# EasyEDA Pro project ProProject_运放实验_2024-09-24.epro, board PCB_all
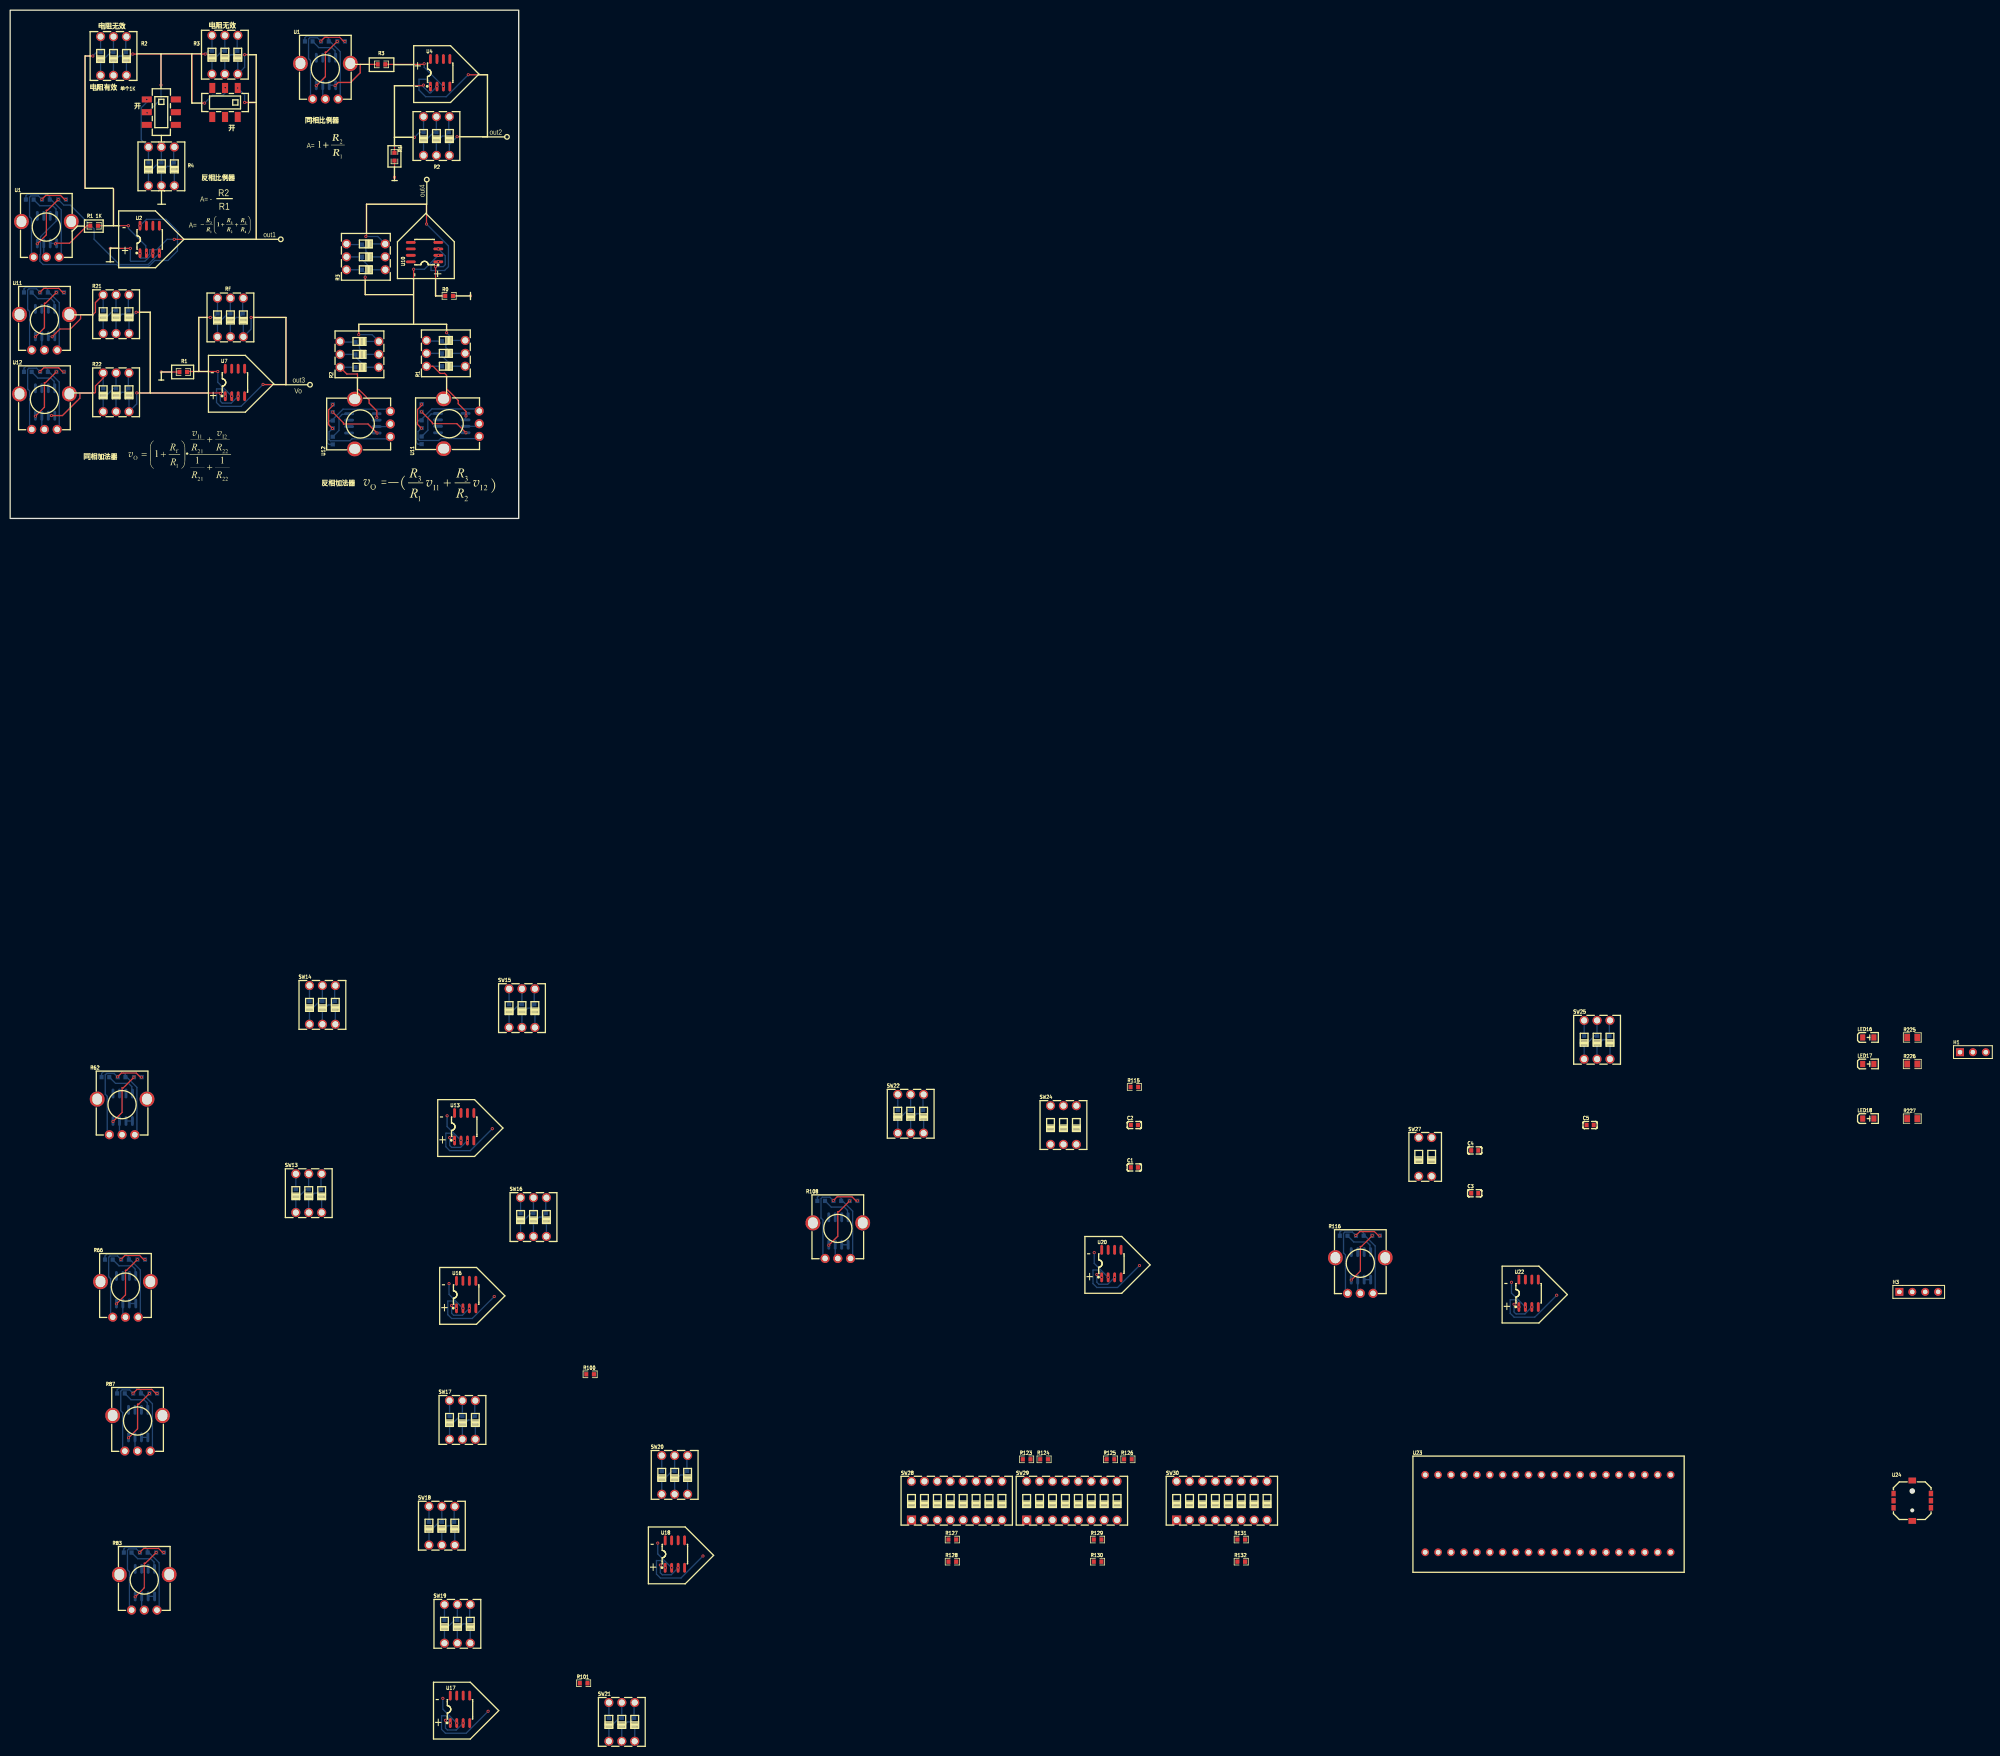
[diagram p9: board, top side]
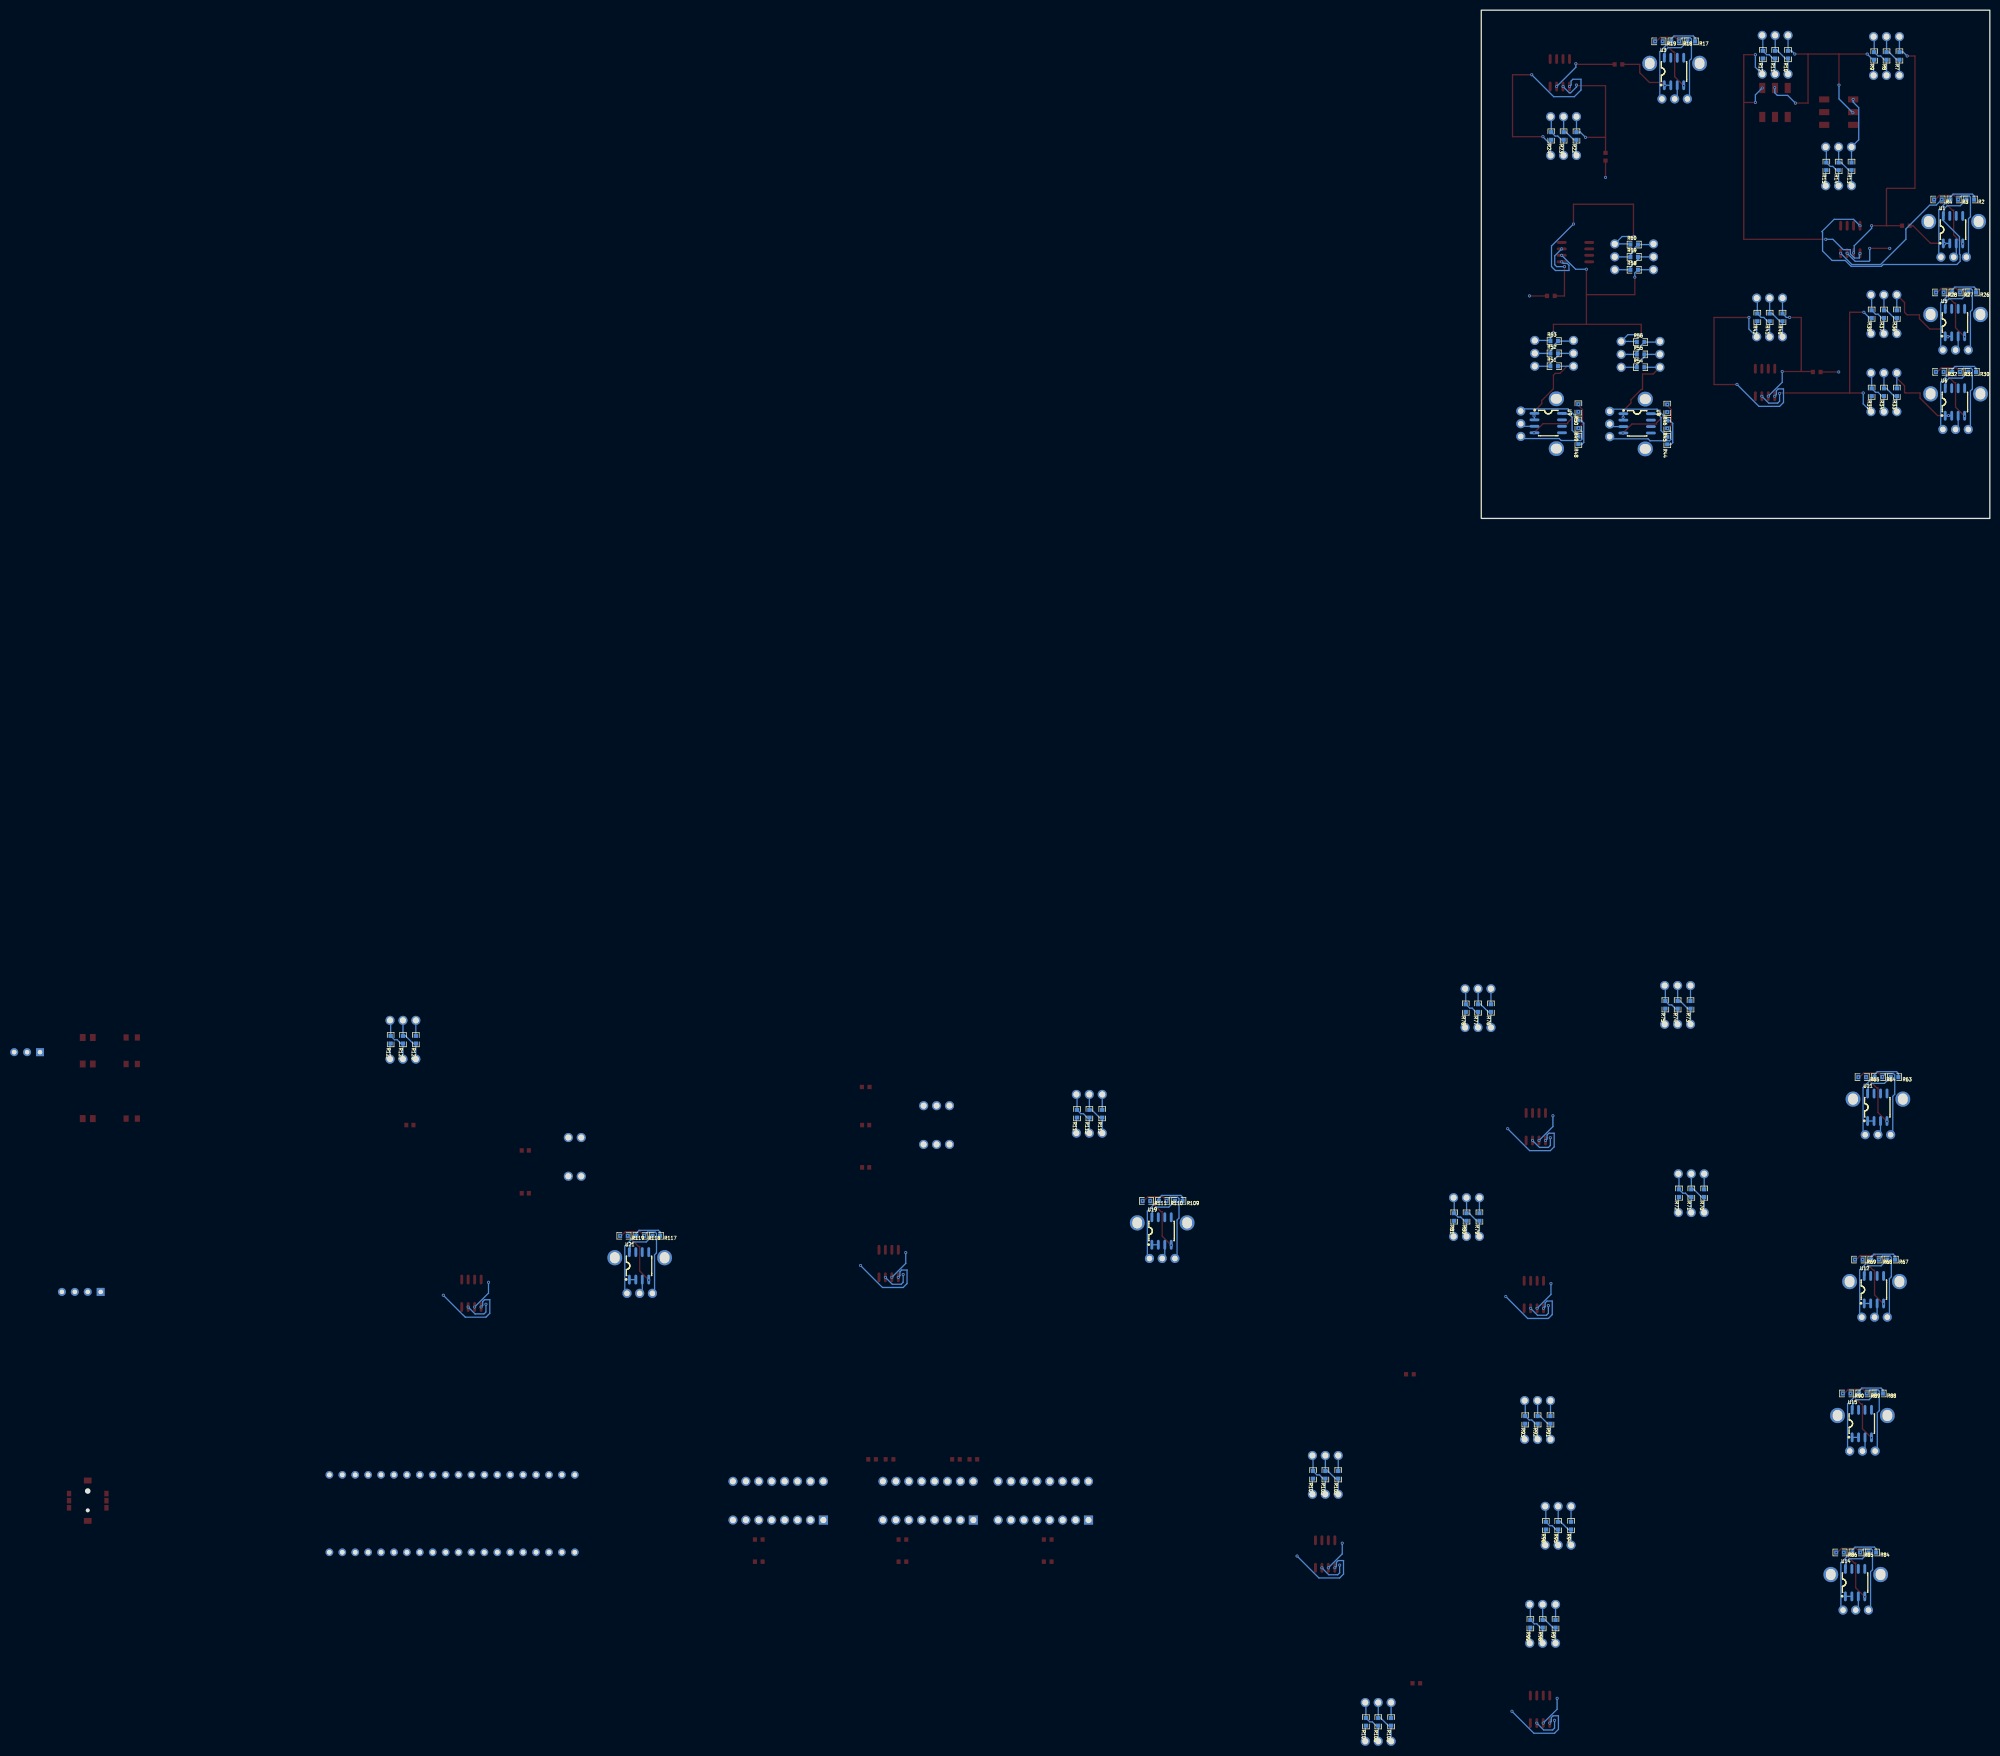
[diagram p10: board, bottom side, seen from below]

Outline 374.56 x 295.55 mm; copper layers: Top Layer, Bottom Layer. Coordinates in mm from the lower left corner of the outline.
Outline path: rectangle 0,295.55 100,195.55
Stack: Top Layer 0.035mm - / Dielectric1 1.51mm FR4 er 4.5 / Bottom Layer 0.035mm -

## Design rules (mm)
template: JLCPCB Capability(Two Layers Board)
spacing copperThickness1oz (default): track to track 0.102, other pairs 0.152 to 0.3
spacing copperThickness2oz: track to track 0.203, other pairs 0.152 to 0.3
track width copperThickness1oz (default): min 0.127, default 0.254, max 2.54
track width copperThickness2oz: min 0.203, default 0.254, max 2.54
differential pair differentialPair (default): width min 0.127, default 0.254, max 2.54; gap min 0.152, default 0.152
via viaSize (default): diameter min 0.5, default 0.61, max 10; hole min 0.3, default 0.305, max 6.3

## Placement (name value [footprint] x y rotation side)
C1  100uF  [C0603]  221.06 67.86 0 top
C2  1uF  [C0603]  221.06 76.2 0 top
C3  100uF  [C0603]  287.98 62.78 0 top
C4  1uF  [C0603]  287.98 71.21 0 top
C5  1uF  [C0603]  310.67 76.2 0 top
H1  HDR-F-2.54_1x3  [HDR-F-2.54_1X3]  385.94 90.54 0 top
H3  HDR-F-2.54_1x4  [HDR-F-2.54_1X4]  375.29 43.38 0 top
LED16  -  [LED_0805]  365.42 93.43 0 top
LED17  -  [LED_0805]  365.42 88.21 0 top
LED18  -  [LED_0805]  365.42 77.47 0 top
R0  1kΩ  [R0603]  86.32 239.34 0 top
R1  1kΩ  [SW-TH_DSWB03LHGET]  85.67 228.03 90 top
R1 1K  1kΩ  [R0603]  16.51 253.14 180 top
R1#2  -  [R0603]  75.56 266.72 270 top
R1#3  -  [R0603]  34.04 224.36 180 top
R2  4kΩ  [SW-TH_DSWB03LHGET]  20.32 286.53 0 top
R2#2  -  [SW-TH_DSWB03LHGET]  83.82 270.78 0 top
R2#3  -  [SW-TH_DSWB03LHGET]  68.68 227.83 90 top
R2#4  -  [R0603]  3.84 258.29 0 bottom
R3  2kΩ  [SW-TH_DSWB03LHGET]  42.22 286.78 0 top
R3#2  -  [SW-TH_DSWB03LHGET]  69.94 247.02 90 top
R3#3  -  [R0603]  73.03 284.88 180 top
R3#4  -  [R0603]  7.02 258.29 0 bottom
R4  4kΩ  [SW-TH_DSWB03LHGET]  29.74 264.82 0 top
R4#2  -  [R0603]  10.21 258.29 0 bottom
R7  1kΩ  [R0603]  17.78 286.54 90 bottom
R8  1kΩ  [R0603]  20.31 286.54 90 bottom
R9  1kΩ  [R0603]  22.73 286.54 90 bottom
R10  1kΩ  [R0603]  39.68 286.8 90 bottom
R11  1kΩ  [R0603]  42.21 286.8 90 bottom
R12  1kΩ  [R0603]  44.63 286.8 90 bottom
R13  1kΩ  [R0603]  27.2 264.83 90 bottom
R14  1kΩ  [R0603]  29.73 264.83 90 bottom
R15  1kΩ  [R0603]  32.15 264.83 90 bottom
R17  4kΩ  [R0603]  58.71 289.41 0 bottom
R18  2kΩ  [R0603]  61.89 289.41 0 bottom
R19  4kΩ  [R0603]  65.07 289.41 0 bottom
R21  1kΩ  [SW-TH_DSWB03LHGET]  20.83 235.73 0 top
R22  1kΩ  [SW-TH_DSWB03LHGET]  20.83 220.37 0 top
R22#2  -  [R0603]  81.28 270.8 90 bottom
R23  1kΩ  [R0603]  83.81 270.8 90 bottom
R24  1kΩ  [R0603]  86.23 270.8 90 bottom
R26  4kΩ  [R0603]  3.47 240.01 0 bottom
R27  2kΩ  [R0603]  6.65 240.01 0 bottom
R28  4kΩ  [R0603]  9.83 240.01 0 bottom
R30  4kΩ  [R0603]  3.47 224.39 0 bottom
R31  2kΩ  [R0603]  6.65 224.39 0 bottom
R32  4kΩ  [R0603]  9.83 224.39 0 bottom
R33  1kΩ  [R0603]  18.29 220.38 90 bottom
R34  1kΩ  [R0603]  20.82 220.38 90 bottom
R35  1kΩ  [R0603]  23.24 220.38 90 bottom
R36  1kΩ  [R0603]  18.29 235.74 90 bottom
R37  1kΩ  [R0603]  20.82 235.74 90 bottom
R38  1kΩ  [R0603]  23.24 235.74 90 bottom
R40  1kΩ  [R0603]  40.77 235.11 90 bottom
R41  1kΩ  [R0603]  43.3 235.11 90 bottom
R42  1kΩ  [R0603]  45.72 235.11 90 bottom
R44  4kΩ  [R0603]  63.42 210.86 90 bottom
R45  2kΩ  [R0603]  63.42 214.04 90 bottom
R46  4kΩ  [R0603]  63.42 217.23 90 bottom
R48  4kΩ  [R0603]  80.9 210.92 90 bottom
R49  2kΩ  [R0603]  80.9 214.1 90 bottom
R50  4kΩ  [R0603]  80.9 217.28 90 bottom
R51  1kΩ  [R0603]  85.66 225.49 180 bottom
R52  1kΩ  [R0603]  85.66 228.02 180 bottom
R53  1kΩ  [R0603]  85.66 230.45 180 bottom
R54  1kΩ  [R0603]  68.67 225.29 180 bottom
R55  1kΩ  [R0603]  68.67 227.82 180 bottom
R56  1kΩ  [R0603]  68.67 230.25 180 bottom
R58  1kΩ  [R0603]  69.93 244.48 180 bottom
R59  1kΩ  [R0603]  69.93 247.01 180 bottom
R60  1kΩ  [R0603]  69.93 249.43 180 bottom
R62  1kΩ  [RES-ADJ-TH_RK09K1130AJ3]  22 77.8 0 top
R63  4kΩ  [R0603]  18.74 85.63 0 bottom
R64  2kΩ  [R0603]  21.91 85.63 0 bottom
R65  4kΩ  [R0603]  25.1 85.63 0 bottom
R66  1kΩ  [RES-ADJ-TH_RK09K1130AJ3]  22.67 41.9 0 top
R67  4kΩ  [R0603]  19.4 49.73 0 bottom
R68  2kΩ  [R0603]  22.58 49.73 0 bottom
R69  4kΩ  [R0603]  25.77 49.73 0 bottom
R70  1kΩ  [R0603]  56.17 62.81 90 bottom
R71  1kΩ  [R0603]  58.7 62.81 90 bottom
R72  1kΩ  [R0603]  61.12 62.81 90 bottom
R73  1kΩ  [R0603]  58.86 99.85 90 bottom
R74  1kΩ  [R0603]  61.38 99.85 90 bottom
R75  1kΩ  [R0603]  63.81 99.85 90 bottom
R76  1kΩ  [R0603]  98.1 99.22 90 bottom
R77  1kΩ  [R0603]  100.63 99.22 90 bottom
R78  1kΩ  [R0603]  103.05 99.22 90 bottom
R79  1kΩ  [R0603]  100.37 58.11 90 bottom
R80  1kΩ  [R0603]  102.89 58.11 90 bottom
R81  1kΩ  [R0603]  105.32 58.11 90 bottom
R83  1kΩ  [RES-ADJ-TH_RK09K1130AJ3]  26.37 -15.73 0 top
R84  4kΩ  [R0603]  23.1 -7.9 0 bottom
R85  2kΩ  [R0603]  26.28 -7.9 0 bottom
R86  4kΩ  [R0603]  29.46 -7.9 0 bottom
R87  1kΩ  [RES-ADJ-TH_RK09K1130AJ3]  25.05 15.56 0 top
R88  4kΩ  [R0603]  21.78 23.39 0 bottom
R89  2kΩ  [R0603]  24.96 23.39 0 bottom
R90  4kΩ  [R0603]  28.14 23.39 0 bottom
R91  1kΩ  [R0603]  86.39 18.19 90 bottom
R92  1kΩ  [R0603]  88.92 18.19 90 bottom
R93  1kΩ  [R0603]  91.35 18.19 90 bottom
R94  1kΩ  [R0603]  82.35 -2.61 90 bottom
R95  1kΩ  [R0603]  84.88 -2.61 90 bottom
R96  1kΩ  [R0603]  87.3 -2.61 90 bottom
R97  1kΩ  [R0603]  85.4 -21.92 90 bottom
R98  1kΩ  [R0603]  87.92 -21.92 90 bottom
R99  1kΩ  [R0603]  90.35 -21.92 90 bottom
R100  1kΩ  [R0603]  114.04 27.16 0 top
R101  1kΩ  [R0603]  112.77 -33.62 0 top
R102  1kΩ  [R0603]  128.12 7.38 90 bottom
R103  1kΩ  [R0603]  130.65 7.38 90 bottom
R104  1kΩ  [R0603]  133.08 7.38 90 bottom
R105  1kΩ  [R0603]  117.73 -41.21 90 bottom
R106  1kΩ  [R0603]  120.26 -41.21 90 bottom
R107  1kΩ  [R0603]  122.68 -41.21 90 bottom
R108  1kΩ  [RES-ADJ-TH_RK09K1130AJ3]  162.74 53.45 0 top
R109  4kΩ  [R0603]  159.48 61.28 0 bottom
R110  2kΩ  [R0603]  162.65 61.28 0 bottom
R111  4kΩ  [R0603]  165.84 61.28 0 bottom
R112  1kΩ  [R0603]  174.53 78.43 90 bottom
R113  1kΩ  [R0603]  177.06 78.43 90 bottom
R114  1kΩ  [R0603]  179.49 78.43 90 bottom
R115  1MΩ  [R0603]  221.06 83.7 0 top
R116  1kΩ  [RES-ADJ-TH_RK09K1130AJ3]  265.49 46.6 0 top
R117  4kΩ  [R0603]  262.22 54.43 0 bottom
R118  2kΩ  [R0603]  265.4 54.43 0 bottom
R119  4kΩ  [R0603]  268.58 54.43 0 bottom
R120  1kΩ  [R0603]  309.5 93 90 bottom
R121  1kΩ  [R0603]  312.03 93 90 bottom
R122  1kΩ  [R0603]  314.45 93 90 bottom
R123  1kΩ  [R0603]  199.88 10.43 0 top
R124  1kΩ  [R0603]  203.3 10.43 0 top
R125  1kΩ  [R0603]  216.36 10.43 0 top
R126  1kΩ  [R0603]  219.79 10.43 0 top
R127  7kΩ  [R0603]  185.25 -5.35 0 top
R128  3kΩ  [R0603]  185.25 -9.7 0 top
R129  7kΩ  [R0603]  213.82 -5.35 0 top
R130  3kΩ  [R0603]  213.82 -9.7 0 top
R131  7kΩ  [R0603]  242.07 -5.35 0 top
R132  3kΩ  [R0603]  242.07 -9.7 0 top
R225  1k  [R0805]  374.02 93.43 0 top
R226  1k  [R0805]  374.02 88.21 0 top
R227  1k  [R0805]  374.02 77.47 0 top
RF  DSWB03LHGET  [SW-TH_DSWB03LHGET]  43.31 235.1 0 top
SW13  DSWB03LHGET  [SW-TH_DSWB03LHGET]  58.71 62.8 0 top
SW14  DSWB03LHGET  [SW-TH_DSWB03LHGET]  61.4 99.84 0 top
SW15  DSWB03LHGET  [SW-TH_DSWB03LHGET]  100.64 99.21 0 top
SW16  DSWB03LHGET  [SW-TH_DSWB03LHGET]  102.91 58.1 0 top
SW17  DSWB03LHGET  [SW-TH_DSWB03LHGET]  88.93 18.18 0 top
SW18  DSWB03LHGET  [SW-TH_DSWB03LHGET]  84.89 -2.62 0 top
SW19  DSWB03LHGET  [SW-TH_DSWB03LHGET]  87.94 -21.93 0 top
SW20  DSWB03LHGET  [SW-TH_DSWB03LHGET]  130.66 7.37 0 top
SW21  DSWB03LHGET  [SW-TH_DSWB03LHGET]  120.27 -41.22 0 top
SW22  DSWB03LHGET  [SW-TH_DSWB03LHGET]  177.07 78.42 0 top
SW24  DSWB03LHGET  [SW-TH_DSWB03LHGET]  207.11 76.2 0 top
SW25  DSWB03LHGET  [SW-TH_DSWB03LHGET]  312.04 92.98 0 top
SW27  DSWB02LHGET  [SW-TH_DSWB02LHGET]  278.24 69.94 0 top
SW28  DSWB08LHGET  [SW-TH_DSWB08LHGET]  186.12 2.3 0 top
SW29  DSWB08LHGET  [SW-TH_DSWB08LHGET]  208.77 2.3 0 top
SW30  DSWB08LHGET  [SW-TH_DSWB08LHGET]  238.26 2.3 0 top
SW31  MST22D18G2  [SW-SMD_MST22D18G2]  29.72 275.48 270 top
SW32  MST22D18G2  [SW-SMD_MST22D18G2]  42.24 277.39 180 top
U1  LM393DR  [RES-ADJ-TH_RK09K1130AJ3]  7.11 250.46 0 top
U1#2  -  [RES-ADJ-TH_RK09K1130AJ3]  61.98 281.58 0 top
U1#3  -  [SOIC-8_L5.0-W4.0-P1.27-LS6.0-BL]  7.24 252.37 180 bottom
U2  LM393DR  [SOIC-8_L5.0-W4.0-P1.27-LS6.0-BL]  27.43 250.44 0 top
U3  LM393DR  [SOIC-8_L5.0-W4.0-P1.27-LS6.0-BL]  62.1 283.48 180 bottom
U4  LM393DR  [SOIC-8_L5.0-W4.0-P1.27-LS6.0-BL]  84.55 283.23 0 top
U5  LM393DR  [SOIC-8_L5.0-W4.0-P1.27-LS6.0-BL]  6.86 234.08 180 bottom
U6  LM393DR  [SOIC-8_L5.0-W4.0-P1.27-LS6.0-BL]  6.86 218.46 180 bottom
U7  LM393DR  [SOIC-8_L5.0-W4.0-P1.27-LS6.0-BL]  44.2 222.3 0 top
U8  LM393DR  [SOIC-8_L5.0-W4.0-P1.27-LS6.0-BL]  69.35 214.26 270 bottom
U9  LM393DR  [SOIC-8_L5.0-W4.0-P1.27-LS6.0-BL]  86.83 214.31 270 bottom
U10  LM393DR  [SOIC-8_L5.0-W4.0-P1.27-LS6.0-BL]  81.48 247.95 90 top
U11  LM393DR  [RES-ADJ-TH_RK09K1130AJ3]  6.74 232.18 0 top
U11#2  -  [RES-ADJ-TH_RK09K1130AJ3]  88.73 214.19 90 top
U11#3  -  [SOIC-8_L5.0-W4.0-P1.27-LS6.0-BL]  22.13 79.7 180 bottom
U12  LM393DR  [RES-ADJ-TH_RK09K1130AJ3]  6.74 216.56 0 top
U12#2  -  [RES-ADJ-TH_RK09K1130AJ3]  71.25 214.13 90 top
U12#3  -  [SOIC-8_L5.0-W4.0-P1.27-LS6.0-BL]  22.8 43.81 180 bottom
U13  LM393DR  [SOIC-8_L5.0-W4.0-P1.27-LS6.0-BL]  89.28 75.87 0 top
U14  LM393DR  [SOIC-8_L5.0-W4.0-P1.27-LS6.0-BL]  26.5 -13.83 180 bottom
U15  LM393DR  [SOIC-8_L5.0-W4.0-P1.27-LS6.0-BL]  25.18 17.46 180 bottom
U16  LM393DR  [SOIC-8_L5.0-W4.0-P1.27-LS6.0-BL]  89.66 42.85 0 top
U17  LM393DR  [SOIC-8_L5.0-W4.0-P1.27-LS6.0-BL]  88.45 -38.75 0 top
U18  LM393DR  [SOIC-8_L5.0-W4.0-P1.27-LS6.0-BL]  130.7 -8.21 0 top
U19  LM393DR  [SOIC-8_L5.0-W4.0-P1.27-LS6.0-BL]  162.87 55.36 180 bottom
U20  LM393DR  [SOIC-8_L5.0-W4.0-P1.27-LS6.0-BL]  216.53 48.95 0 top
U21  LM393DR  [SOIC-8_L5.0-W4.0-P1.27-LS6.0-BL]  265.61 48.5 180 bottom
U22  LM393DR  [SOIC-8_L5.0-W4.0-P1.27-LS6.0-BL]  298.58 43.11 0 top
U23  STM32最小系统-fh  [STM32最小系统板]  302.37 0.27 0 top
U24  GT-TCA06F-H050-L1  [KEY-SMD_GT-TCA06F-H050-L1]  374.02 2.3 0 top

## Footprints (pads in the part's own frame, mm; a bottom-side part is the same pattern mirrored in y, then rotated)
C0603
  rect 0.8x0.9 smd: 1(-0.7,0) 2(0.7,0)
HDR-F-2.54_1X3
  rect 1.575x1.575 hole 0.889: 1(-2.54,0)
  round 1.575 hole 0.889: 2(0,0)
  round 1.575 hole 0.914: 3(2.54,0)
HDR-F-2.54_1X4
  rect 1.575x1.575 hole 0.889: 1(-3.81,0)
  round 1.575 hole 0.889: 2(-1.27,0) 3(1.27,0) 4(3.81,0)
KEY-SMD_GT-TCA06F-H050-L1
  rect 0.85x1.1 smd: 1(-3.675,1.4) 2(-3.675,0) 3(-3.675,-1.4) 4(3.675,1.4) 5(3.675,0) 6(3.675,-1.4)
  rect 1.5x1.15 smd: 7(0,3.975) 8(0,-3.975)
LED_0805
  rect 1x1.25 smd: 1(-1.15,0.005) 2(1.05,0.005)
R0603
  rect 0.806x0.864 smd: 1(-0.753,0) 2(0.753,0)
R0805
  rect 1.133x1.377 smd: 1(-1,0) 2(1,0)
RES-ADJ-TH_RK09K1130AJ3
  round 1.8 hole 1.1: 1(-2.5,-3.5) 2(0,-3.5) 3(2.5,-3.5)
  oval 2.9x3 hole 1.9x2.2: 4(-4.9,3.5) 5(4.9,3.5)
SOIC-8_L5.0-W4.0-P1.27-LS6.0-BL
  oval 0.569x1.95 smd: 1(-1.905,-2.705) 2(-0.635,-2.705) 3(0.635,-2.705) 4(1.905,-2.705) 5(1.905,2.705) 6(0.635,2.705) 7(-0.635,2.705) 8(-1.905,2.705)
STM32最小系统板
  round 1.524 hole 0.919x0.914: 1(-24.13,7.112) 2(-21.59,7.112) 3(-19.05,7.112) 4(-16.51,7.112) 5(-13.97,7.112) 6(-11.43,7.112) 7(-8.89,7.112) 8(-6.35,7.112) 9(-3.81,7.112) 10(-1.27,7.112) 11(1.27,7.112) 12(3.81,7.112) 13(6.35,7.112) 14(8.89,7.112) 15(11.43,7.112) 16(13.97,7.112) 17(16.51,7.112) 18(19.05,7.112) 19(21.59,7.112) 20(24.13,7.112) 21(24.13,-8.128) 22(21.59,-8.128) 23(19.05,-8.128) 24(16.51,-8.128) 25(13.97,-8.128) 26(11.43,-8.128) 27(8.89,-8.128) 28(6.35,-8.128) 29(3.81,-8.128) 30(1.27,-8.128) 31(-1.27,-8.128) 32(-3.81,-8.128) 33(-6.35,-8.128) 34(-8.89,-8.128) 35(-11.43,-8.128) 36(-13.97,-8.128) 37(-16.51,-8.128) 38(-19.05,-8.128) 39(-21.59,-8.128) 40(-24.13,-8.128)
SW-SMD_MST22D18G2
  rect 1.2x2 smd: 1(-2.5,2.85) 2(0,2.85) 3(2.5,2.85) 4(-2.5,-2.85) 5(0,-2.85) 6(2.5,-2.85)
SW-TH_DSWB02LHGET
  round 1.8 hole 1.2: 1(-1.27,3.81) 2(1.27,3.81) 3(-1.27,-3.81) 4(1.27,-3.81)
SW-TH_DSWB03LHGET
  round 1.8 hole 1.2: 1(-2.54,3.81) 2(0,3.81) 3(2.54,3.81) 4(-2.54,-3.81) 5(0,-3.81) 6(2.54,-3.81)
SW-TH_DSWB08LHGET
  rect 1.8x1.8 hole 1.2: 1(-8.89,-3.81)
  round 1.8 hole 1.2: 2(-6.35,-3.81) 3(-3.81,-3.81) 4(-1.27,-3.81) 5(1.27,-3.81) 6(3.81,-3.81) 7(6.35,-3.81) 8(8.89,-3.81) 9(-8.89,3.81) 10(-6.35,3.81) 11(-3.81,3.81) 12(-1.27,3.81) 13(1.27,3.81) 14(3.81,3.81) 15(6.35,3.81) 16(8.89,3.81)

## Nets
+5V: LED17.2 R2#4.2 R17.2 R26.2 R30.2 R44.2 R48.2 R63.2 R67.2 R84.2 R88.2 R109.2 R117.2 U1#3.8 U2.8 U3.8 U4.8 U5.8 U6.8 U7.8 U8.8 U9.8 U10.8 U11#3.8 U12#3.8 U13.8 U14.8 U15.8 U16.8 U17.8 U18.8 U19.8 U20.8 U21.8 U22.8
-5V: H1.2 H3.1 R4#2.1 R19.1 R28.1 R32.1 R46.1 R50.1 R65.1 R69.1 R86.1 R90.1 R111.1 R119.1 R128.1 R130.1 R132.1 R225.1 R227.1 U1#3.4 U2.4 U3.4 U4.4 U5.4 U6.4 U7.4 U8.4 U9.4 U10.4 U11#3.4 U12#3.4 U13.4 U14.4 U15.4 U16.4 U17.4 U18.4 U19.4 U20.4 U21.4 U22.4 U23.1 U23.2 U23.22
GND: H1.3 LED16.2 R0.2 R1#2.2 R1#3.2 R4.6 R15.1 R78.1 R107.1 R123.2 R124.2 R125.2 R126.2 R226.1 SW15.6 SW21.6 U2.3 U20.3 U22.3
1_FAN_XIANG_BI_LI_QI_IN: R1 1K.2 SW28.1 U1#3.1 U1#3.2
1_FAN_XIANG_BI_LI_QI_OUT: R3.6 R12.1 SW30.1 SW32.4 U2.1
2_TONG_XIANG_BI_LI_QI_IN: R3#3.2 SW28.2 U3.1 U3.2
2_TONG_XIANG_BI_LI_QI_OUT: R2#2.6 R24.1 SW30.2 U4.1
3_TONG_XIANG_JIA_FA_QI_IN1: R21.1 R36.2 SW28.3 U5.1 U5.2
3_TONG_XIANG_JIA_FA_QI_IN2: R22.1 R33.2 SW29.3 U6.1 U6.2
3_TONG_XIANG_JIA_FA_QI_OUT: R42.1 RF.6 SW30.3 U7.1
4_FAN_XIANG_JIA_FA_QI_IN1: R2#3.1 R54.2 SW28.4 U8.1 U8.2
4_FAN_XIANG_JIA_FA_QI_IN2: R1.1 R51.2 SW29.4 U9.1 U9.2
4_FAN_XIANG_JIA_FA_QI_OUT: R3#2.6 R60.1 SW30.4 U10.1
5_JIAN_FA_QI_IN1: R73.2 SW14.1 SW28.5 U11#3.1 U11#3.2
5_JIAN_FA_QI_IN2: R70.2 SW13.1 SW29.5 U12#3.1 U12#3.2
5_JIAN_FA_QI_OUT: R81.1 SW16.6 SW30.5 U13.1
6_YI_YONG_FANG_DA_QI_IN1: SW28.6 U15.1 U15.2 U16.3
6_YI_YONG_FANG_DA_QI_IN2: SW29.6 U14.1 U14.2 U17.3
6_YI_YONG_FANG_DA_QI_OUT: R104.1 SW20.6 SW30.6 U18.1
7_JI_FEN_IN: R112.2 SW22.1 SW28.7 U19.1 U19.2
7_JI_FEN_OUT: C1.2 C2.2 R115.1 SW30.7 U20.1
8_WEI_FEN_IN: SW27.1 SW27.2 SW28.8 U21.1 U21.2
8_WEI_FEN_OUT: C5.2 R122.1 SW25.6 SW30.8 U22.1
-5+3.3V: H1.1 H3.2 LED18.2 U23.3 U23.21 U24.2
A0: R127.1 R128.2 U23.16
A1: R129.1 R130.2 U23.15
A2: R131.1 R132.2 U23.14
A3: U23.13
A4: U23.12
A5: U23.11
A6: U23.10
A7: U23.9
A8: U23.36 U24.1
A9: U23.35 U24.3
A10: U23.34 U24.6
A11: U23.33 U24.5
A12: U23.32 U24.4
A15: U23.31
B0: U23.8
B1: U23.7
B3: U23.30
B4: U23.29
B5: U23.28
B6: U23.27
B7: U23.26
B8: H3.3 U23.25
B9: H3.4 U23.24
B10: U23.6
B11: U23.5
B12: U23.40
B13: U23.39
B14: U23.38
B15: U23.37
C13: U23.19
C14: U23.18
C15: U23.17
RST: U23.4
VBT: U23.20
$1N396: R2#4.1 R3#4.2 U1.3
$1N406: R3#4.1 R4#2.2 U1.1
$1N426: U1.2 U1#3.3
$1N864: R2.2 R2.4 R7.1 R8.2
$1N884: R2.3 R2.5 R8.1 R9.2
$1N1057: R3.2 R3.4 R10.1 R11.2
$1N1065: R3.3 R3.5 R11.1 R12.2
$1N1238: R4.2 R4.4 R13.1 R14.2
$1N1246: R4.3 R4.5 R14.1 R15.2
$1N1500: R1 1K.1 R2.1 R7.2 U2.2
$1N1717: R4.1 R13.2 SW31.4
$1N1726: R2.6 R3.1 R9.1 R10.2 SW31.5 SW32.5
$1N1964: R17.1 R18.2 U1#2.3
$1N1967: R18.1 R19.2 U1#2.1
$1N1978: U1#2.2 U3.3
$1N2081: R3#3.1 U4.3
$1N2301: R2#2.2 R2#2.4 R22#2.1 R23.2
$1N2309: R2#2.3 R2#2.5 R23.1 R24.2
$1N2335: R1#2.1 R2#2.1 R22#2.2 U4.2
$1N2569: R26.1 R27.2 U11.3
$1N2572: R27.1 R28.2 U11.1
$1N2583: U5.3 U11.2
$1N2820: R30.1 R31.2 U12.3
$1N2823: R31.1 R32.2 U12.1
$1N2834: U6.3 U12.2
$1N3003: R22.2 R22.4 R33.1 R34.2
$1N3011: R22.3 R22.5 R34.1 R35.2
$1N3184: R21.2 R21.4 R36.1 R37.2
$1N3192: R21.3 R21.5 R37.1 R38.2
$1N3292: R21.6 R22.6 R35.1 R38.1 U7.3
$1N3532: R40.1 R41.2 RF.2 RF.4
$1N3540: R41.1 R42.2 RF.3 RF.5
$1N3559: R1#3.1 R40.2 RF.1 U7.2
$1N4590: R44.1 R45.2 U12#2.3
$1N4593: R45.1 R46.2 U12#2.1
$1N4604: U8.3 U12#2.2
$1N4614: R48.1 R49.2 U11#2.3
$1N4617: R49.1 R50.2 U11#2.1
$1N4628: U9.3 U11#2.2
$1N4635: R1.2 R1.4 R51.1 R52.2
$1N4643: R1.3 R1.5 R52.1 R53.2
$1N4651: R2#3.2 R2#3.4 R54.1 R55.2
$1N4659: R2#3.3 R2#3.5 R55.1 R56.2
$1N4698: R3#2.2 R3#2.4 R58.1 R59.2
$1N4706: R3#2.3 R3#2.5 R59.1 R60.2
$1N4742: R1.6 R2#3.6 R3#2.1 R53.1 R56.1 R58.2 U10.2
$1N4816: R0.1 U10.3
$1N5564: R62.3 R63.1 R64.2
$1N5567: R62.1 R64.1 R65.2
$1N5578: R62.2 U11#3.3
$1N5588: R66.3 R67.1 R68.2
$1N5591: R66.1 R68.1 R69.2
$1N5602: R66.2 U12#3.3
$1N5609: R70.1 R71.2 SW13.2 SW13.4
$1N5617: R71.1 R72.2 SW13.3 SW13.5
$1N5625: R73.1 R74.2 SW14.2 SW14.4
$1N5633: R74.1 R75.2 SW14.3 SW14.5
$1N5932: R76.1 R77.2 SW15.2 SW15.4
$1N5940: R77.1 R78.2 SW15.3 SW15.5
$1N5959: R75.1 R76.2 SW14.6 SW15.1 U13.3
$1N6163: R79.1 R80.2 SW16.2 SW16.4
$1N6171: R80.1 R81.2 SW16.3 SW16.5
$1N6191: R72.1 R79.2 SW13.6 SW16.1 U13.2
$1N6501: R83.3 R84.1 R85.2
$1N6504: R83.1 R85.1 R86.2
$1N6515: R83.2 U14.3
$1N6753: R87.3 R88.1 R89.2
$1N6756: R87.1 R89.1 R90.2
$1N6767: R87.2 U15.3
$1N7112: R91.1 R92.2 SW17.2 SW17.4
$1N7120: R92.1 R93.2 SW17.3 SW17.5
$1N7297: R94.1 R95.2 SW18.2 SW18.4
$1N7305: R95.1 R96.2 SW18.3 SW18.5
$1N7478: R97.1 R98.2 SW19.2 SW19.4
$1N7486: R98.1 R99.2 SW19.3 SW19.5
$1N7519: R91.2 R94.2 SW17.1 SW18.1 U16.2
$1N7528: R93.1 R100.2 SW17.6 U16.1
$1N7610: R96.1 R99.1 SW18.6 SW19.6 U17.2
$1N7723: R97.2 R101.2 SW19.1 U17.1
$1N7950: R102.1 R103.2 SW20.2 SW20.4
$1N7958: R103.1 R104.2 SW20.3 SW20.5
$1N8133: R105.1 R106.2 SW21.2 SW21.4
$1N8141: R106.1 R107.2 SW21.3 SW21.5
$1N8558: R101.1 R105.2 SW21.1 U18.3
$1N8570: R100.1 R102.2 SW20.1 U18.2
$1N8808: R108.3 R109.1 R110.2
$1N8811: R108.1 R110.1 R111.2
$1N8822: R108.2 U19.3
$1N9066: R112.1 R113.2 SW22.2 SW22.4
$1N9074: R113.1 R114.2 SW22.3 SW22.5
$1N9289: C1.1 SW24.4
$1N9422: C2.1 SW24.5
$1N9426: R114.1 SW22.6 SW24.1 SW24.2 SW24.3 U20.2
$1N9437: R115.2 SW24.6
$1N10669: R116.3 R117.1 R118.2
$1N10672: R116.1 R118.1 R119.2
$1N10683: R116.2 U21.3
$1N10903: R120.1 R121.2 SW25.2 SW25.4
$1N10911: R121.1 R122.2 SW25.3 SW25.5
$1N11058: C3.1 SW27.3
$1N11164: C4.1 SW27.4
$1N11228: C3.2 C4.2 C5.1 R120.2 SW25.1 U22.2
$1N11683: R123.1 SW29.1
$1N11722: R124.1 SW29.2
$1N11761: R125.1 SW29.7
$1N11800: R126.1 SW29.8
$1N16821: R127.2 SW28.9 SW28.10 SW28.11 SW28.12 SW28.13 SW28.14 SW28.15 SW28.16
$1N16840: R129.2 SW29.9 SW29.10 SW29.11 SW29.12 SW29.13 SW29.14 SW29.15 SW29.16
$1N16862: R131.2 SW30.9 SW30.10 SW30.11 SW30.12 SW30.13 SW30.14 SW30.15 SW30.16
$1N26687: LED16.1 R225.2
$1N26764: LED17.1 R226.2
$1N26843: LED18.1 R227.2

Pads without a net: R62 4 5; R66 4 5; R83 4 5; R87 4 5; R108 4 5; R116 4 5; SW31 1 2 3 6; SW32 1 2 3 6; U1 4 5; U1#2 4 5; U1#3 5 6 7; U2 5 6 7; U3 5 6 7; U4 5 6 7; U5 5 6 7; U6 5 6 7; U7 5 6 7; U8 5 6 7; U9 5 6 7; U10 5 6 7; U11 4 5; U11#2 4 5; U11#3 5 6 7; U12 4 5; U12#2 4 5; U12#3 5 6 7; U13 5 6 7; U14 5 6 7; U15 5 6 7; U16 5 6 7; U17 5 6 7; U18 5 6 7; U19 5 6 7; U20 5 6 7; U21 5 6 7; U22 5 6 7; U23 23; U24 7 8

## Via types
v1: diameter 0.61, hole 0.305, Top Layer to Bottom Layer, 141 vias

## Routing (per net, layer and track width the routed paths; a pad name or vN(x,y) marks a point on that pad's centre or on a via; arc(x,y) is an arc through that point)
+5V: length 131.1
  Top Layer w0.254: v1(25.53,253.13) U2.8
  Bottom Layer w0.254: R88.2 23.76,22.16 26.32,22.16 26.95,21.53 26.95,20.3 U15.8 ; v1(25.53,253.13) 26.8,254.4 30.61,254.4 33.02,251.99 32.89,251.86 32.89,248.18 31.02,246.31 28.42,246.31 27.26,245.16 21.32,245.16 20.96,245.51 6.48,245.51 5.84,246.15 5.84,247.42 5.97,247.54 5.97,250.97 9.14,254.15 U1#3.8 9.02,255.2 9.02,256.43 8.38,257.07 5.83,257.07 R2#4.2 ; U6.8 8.64,221.29 8.64,222.53 8.01,223.16 5.45,223.16 R30.2 ; U3.8 63.88,286.31 63.88,287.55 63.25,288.18 60.69,288.18 R17.2 ; 84.13,216.22 84,216.09 82.77,216.09 82.13,215.46 82.13,212.9 R48.2 ; U12#3.8 24.58,46.64 24.58,47.87 23.94,48.51 21.38,48.51 R67.2 ; 19.49,85.63 20.72,84.4 23.27,84.4 23.91,83.77 23.91,82.54 U11#3.8 ; 28.4,-11.12 28.27,-10.99 28.27,-9.76 27.64,-9.13 25.08,-9.13 R84.2 ; R26.2 5.45,238.78 8.01,238.78 8.64,238.15 8.64,236.91 U5.8 ; R117.2 264.2,53.2 266.76,53.2 267.39,52.56 267.39,51.33 U21.8 ; R44.2 64.65,212.85 64.65,215.4 65.29,216.04 66.52,216.04 66.64,216.16 ; U19.8 164.65,58.19 164.65,59.42 164.01,60.06 161.46,60.06 R109.2
-5V: length 155.1
  Top Layer w0.254: v1(60.2,280.69) 61.98,282.47 61.98,287.29 62.2,287.29 v1(64.32,289.41) ; v1(9.08,240.01) 6.96,237.89 6.74,237.89 6.74,233.07 v1(4.96,231.29) ; v1(5.33,249.57) 7.11,251.35 7.11,256.18 7.34,256.18 v1(9.45,258.29) ; v1(72.14,212.35) 70.37,214.13 65.54,214.13 65.54,214.36 v1(63.42,216.47) ; v1(4.96,215.67) 6.74,217.45 6.74,222.27 6.96,222.27 v1(9.08,224.39) ; v1(23.27,14.67) 25.05,16.45 25.05,21.27 25.27,21.27 v1(27.39,23.39) ; v1(24.59,-16.62) 26.37,-14.84 26.37,-10.02 26.59,-10.02 v1(28.71,-7.9) ; v1(267.83,54.43) 265.71,52.31 265.49,52.31 265.49,47.48 v1(263.71,45.7) ; v1(165.08,61.28) 162.97,59.17 162.74,59.17 162.74,54.34 v1(160.97,52.56) ; v1(80.9,216.53) 83.02,214.41 83.02,214.19 87.85,214.19 v1(89.63,212.41) ; v1(24.34,85.63) 22.23,83.51 22,83.51 22,78.69 v1(20.23,76.91) ; v1(25.01,49.73) 22.89,47.62 22.67,47.62 22.67,42.79 v1(20.89,41.01)
  Bottom Layer w0.254: v1(4.96,231.29) U5.4 ; v1(5.33,249.57) U1#3.4 ; v1(60.2,280.69) 60.2,280.78 ; v1(9.45,258.29) 10.55,257.2 11.81,257.2 16.51,252.5 16.51,250.46 21.46,245.51 27.12,245.51 v1(29.34,247.73) ; v1(263.71,45.7) U21.4 ; v1(160.97,52.56) U19.4 ; v1(24.59,-16.62) U14.4 ; v1(20.89,41.01) U12#3.4 ; v1(89.63,212.41) U9.4 ; v1(4.96,215.67) U6.4 ; v1(23.27,14.67) U15.4 ; v1(72.14,212.35) U8.4 ; v1(20.23,76.91) U11#3.4
GND: length 42.7
  Top Layer w0.254: v1(19.68,248.69) v1(23.62,248.69) ; R1#3.2 v1(29.72,224.36) ; R0.2 v1(90.52,239.34) ; R1#2.2 v1(75.56,262.66)
  Bottom Layer w0.254: R15.1 32.28,263.95 R4.6 ; v1(217.17,46.24) 215.81,44.88 214.06,44.88 213.68,45.26 v1(213.68,46.79) ; SW15.6 103.18,98.34 103.05,98.46 ; R107.1 122.81,-42.09 122.81,-45.03 ; v1(23.62,248.69) 23.62,246.27 23.75,246.15 26.48,246.15 v1(28.07,247.73) ; v1(299.21,40.4) 297.85,39.04 296.1,39.04 295.72,39.42 v1(295.72,40.94)
1_FAN_XIANG_BI_LI_QI_IN: length 9.8
  Top Layer w0.254: 15.88,253.13 15.11,253.13 11.68,249.7 9.02,249.7 v1(8.89,249.58)
  Bottom Layer w0.254: v1(8.89,249.58) 8.85,249.61 8.85,249.66 ; U1#3.2 8.85,249.66 ; 8.85,249.66 U1#3.1
1_FAN_XIANG_BI_LI_QI_OUT: length 77.5
  Top Layer w0.254: v1(32.26,250.46) 48.39,250.46 48.39,277.39 ; 48.39,277.39 48.39,286.79 v1(46.1,286.79) ; 48.39,277.39 v1(46.1,277.39) ; v1(25.53,247.67) U2.1
  Bottom Layer w0.254: v1(46.1,277.39) 46.1,278.88 v1(44.74,280.24) ; v1(46.1,286.79) 46.1,284.32 R3.6 44.76,285.92 R12.1 ; v1(25.53,247.67) 25.65,247.54 25.65,246.78 26.61,246.78 27.43,247.6 27.43,248.43 28.83,248.43 30.86,250.46 v1(32.26,250.46)
2_TONG_XIANG_BI_LI_QI_IN: length 12.5
  Top Layer w0.254: v1(63.88,280.69) 64.52,281.33 66.93,281.33 68.83,283.23 68.83,284.88 R3#3.2
  Bottom Layer w0.254: 62.74,280.78 64.01,280.78 63.92,280.69 v1(63.88,280.69)
2_TONG_XIANG_BI_LI_QI_OUT: length 44.6
  Top Layer w0.254: v1(90.08,282.85) 93.85,282.85 93.85,270.66 v1(87.88,270.66)
  Bottom Layer w0.254: v1(87.88,270.66) 86.36,269.13 ; 86.36,269.13 86.36,269.92 R24.1 ; 86.36,269.13 R2#2.6 ; v1(90.08,282.85) 85.76,278.53 81.7,278.53 80.39,279.83 80.39,281.96 81.98,281.96 82.33,281.61 82.33,280.84 v1(82.65,280.53)
3_TONG_XIANG_JIA_FA_QI_IN1: length 19.4
  Top Layer w0.254: v1(8.25,231.29) 9.78,232.81 11.81,232.81 13.84,234.84 13.84,235.61 16.26,235.61 16.76,236.11 16.76,238.02 R21.1
  Bottom Layer w0.254: v1(8.25,231.29) 8.34,231.38 U5.1 ; U5.2 8.31,231.38 ; R36.2 R21.1
3_TONG_XIANG_JIA_FA_QI_IN2: length 19.9
  Top Layer w0.254: R22.1 18.29,223.16 16.76,221.64 16.76,220.37 16.64,220.24 13.72,220.24 13.72,219.22 10.29,215.79 v1(8.13,215.79)
  Bottom Layer w0.254: R33.2 R22.1 ; 8.12,215.76 8.12,215.79 v1(8.13,215.79) ; 8.12,215.76 U6.1 ; 8.12,215.76 U6.2
3_TONG_XIANG_JIA_FA_QI_OUT: length 48.8
  Top Layer w0.254: v1(47.37,235.1) 54.23,235.1 54.23,221.89 49.75,221.89 v1(49.72,221.92)
  Bottom Layer w0.254: v1(42.29,219.6) 41.97,219.91 41.97,220.68 41.63,221.03 40.58,221.03 40.58,218.36 41.34,217.6 45.4,217.6 v1(49.72,221.92) ; v1(47.37,235.1) 47.37,232.81 45.85,231.29 45.85,234.23 45.72,234.36
4_FAN_XIANG_JIA_FA_QI_IN1: length 18.6
  Top Layer w0.254: v1(72.1,215.46) 72.1,216.73 70.58,218.25 70.58,218.89 68.54,220.92 68.29,220.92 68.29,223.97 66.2,223.97 R2#3.1
  Bottom Layer w0.254: v1(72.1,215.46) 72.06,215.5 ; 72.06,215.5 U8.1 ; 72.06,215.5 U8.2 ; R54.2 R2#3.1
4_FAN_XIANG_JIA_FA_QI_IN2: length 18.7
  Top Layer w0.254: v1(89.63,215.71) 89.63,216.6 88.1,218.12 88.1,218.76 85.82,221.04 85.82,223.71 85.44,224.09 84.55,224.09 83.15,225.49 R1.1
  Bottom Layer w0.254: U9.2 89.54,215.71 ; 89.54,215.71 89.54,215.71 v1(89.63,215.71) ; 89.54,215.71 U9.1 ; R51.2 R1.1
4_FAN_XIANG_JIA_FA_QI_OUT: length 46.3
  Top Layer w0.254: v1(69.94,251.02) 70.07,251.14 70.07,257.37 81.87,257.37 v1(81.87,253.47)
  Bottom Layer w0.254: R60.1 70.81,249.56 R3#2.6 72.29,251.02 v1(69.94,251.02) ; v1(84.19,246.04) 83.87,245.73 83.1,245.73 82.76,245.38 82.76,244.33 85.42,244.33 86.18,245.09 86.18,249.15 v1(81.87,253.47)
5_JIAN_FA_QI_IN1: length 4.3
  Bottom Layer w0.254: U11#3.2 U11#3.1 ; R73.2 SW14.1
5_JIAN_FA_QI_IN2: length 4.3
  Bottom Layer w0.254: 56.17,63.56 SW13.1 ; U12#3.2 U12#3.1
5_JIAN_FA_QI_OUT: length 19.8
  Bottom Layer w0.254: SW16.6 105.45,57.23 R81.1 ; v1(94.81,75.49) 90.49,71.17 86.42,71.17 85.66,71.93 85.66,74.6 86.71,74.6 87.06,74.25 87.06,73.48 v1(87.38,73.17)
6_YI_YONG_FANG_DA_QI_IN1: length 7
  Bottom Layer w0.254: v1(90.3,40.15) 88.93,38.78 87.19,38.78 86.8,39.17 v1(86.8,40.69) ; U15.2 U15.1
6_YI_YONG_FANG_DA_QI_IN2: length 7
  Bottom Layer w0.254: U14.2 U14.1 ; v1(89.08,-41.45) 87.72,-42.82 85.97,-42.82 85.59,-42.44 v1(85.59,-40.91)
6_YI_YONG_FANG_DA_QI_OUT: length 19.8
  Bottom Layer w0.254: SW20.6 133.2,6.5 R104.1 ; v1(128.8,-10.91) 128.48,-10.59 128.48,-9.83 128.13,-9.48 127.08,-9.48 127.08,-12.15 127.85,-12.91 131.91,-12.91 v1(136.23,-8.59)
7_JI_FEN_IN: length 4.3
  Bottom Layer w0.254: R112.2 SW22.1 ; 163.5,52.65 U19.1
7_JI_FEN_OUT: length 16.7
  Bottom Layer w0.254: v1(222.06,48.56) 217.74,44.25 213.68,44.25 212.92,45.01 212.92,47.67 213.97,47.67 214.31,47.33 214.31,46.56 v1(214.63,46.24)
8_WEI_FEN_IN: length 1.3
  Bottom Layer w0.254: U21.2 U21.1
8_WEI_FEN_OUT: length 19.8
  Bottom Layer w0.254: SW25.6 314.58,92.12 R122.1 ; v1(296.67,40.4) 296.35,40.72 296.35,41.48 296.01,41.83 294.96,41.83 294.96,39.17 295.72,38.4 299.78,38.4 v1(304.1,42.72)
$1N396: length 19
  Bottom Layer w0.254: 7.77,258.53 10.03,256.27 10.03,247.39 U1.3 ; 7.77,258.53 7.77,258.82 7.23,259.36 3.44,259.36 3.09,259.01 3.09,258.29 ; 7.77,258.53 R3#4.2
$1N406: length 20.4
  Top Layer w0.254: v1(6.22,258.34) 6.98,259.1 9.91,259.1 10.71,258.29 v1(10.96,258.29)
  Bottom Layer w0.254: U1.1 4.19,247.39 4.19,254.53 3.81,254.91 3.81,258.75 4.06,259.01 5.56,259.01 R3#4.1 6.27,258.29 v1(6.22,258.34)
$1N426: length 2.9
  Bottom Layer w0.254: U1#3.3 6.6,247.47 U1.2
$1N864: length 9.3
  Bottom Layer w0.254: R2.4 R7.1 18.31,285.79 19.81,287.3 R8.2 20.31,290.33 R2.2
$1N884: length 9.2
  Bottom Layer w0.254: R2.3 22.73,290.22 R9.2 21.97,286.53 21.46,286.53 20.72,285.79 R8.1 20.31,282.73 R2.5
$1N1057: length 9.3
  Bottom Layer w0.254: R3.2 42.21,290.58 R11.2 41.71,287.55 40.21,286.04 R10.1 R3.4
$1N1065: length 9.2
  Bottom Layer w0.254: R3.3 44.63,290.47 R12.2 43.87,286.78 43.36,286.78 42.62,286.04 R11.1 42.21,282.99 R3.5
$1N1238: length 9.3
  Bottom Layer w0.254: R4.4 R13.1 27.72,264.07 29.23,265.58 R14.2 29.73,268.61 R4.2
$1N1246: length 9.2
  Bottom Layer w0.254: R4.5 29.73,261.02 R14.1 30.14,264.07 30.88,264.82 31.38,264.82 R15.2 32.15,268.5 R4.3
$1N1500: length 58.2
  Top Layer w0.254: R1 1K.1 20.27,253.14 ; 20.27,253.14 20.32,253.2 20.32,260.37 20.19,260.5 14.73,260.5 14.73,286.53 v1(16.26,286.53) ; 20.27,253.14 v1(23.24,253.14) ; v1(26.8,247.8) U2.2
  Bottom Layer w0.254: R2.1 R7.2 17.02,287.3 v1(16.26,286.53) ; v1(23.24,253.14) 23.24,252.62 26.67,249.19 26.67,247.92 v1(26.8,247.8)
$1N1717: length 13.4
  Bottom Layer w0.254: R13.2 R4.1 25.78,270.04 25.78,276.37 26.87,277.46 v1(26.87,277.98)
$1N1726: length 54.8
  Top Layer w0.254: v1(38.23,277.26) 35.75,277.26 35.75,286.91 ; 29.66,286.91 35.75,286.91 ; 29.66,286.91 v1(29.66,280.82) ; 29.66,286.91 v1(24.11,286.91) ; 35.75,286.91 v1(38.35,286.91) ; SW32.5 42.24,280.26 v1(42.29,280.31) ; v1(26.92,275.36) 26.87,275.41 SW31.5
  Bottom Layer w0.254: 22.86,285.66 v1(24.11,286.91) 24.13,286.91 ; 22.86,285.66 R2.6 ; 22.86,285.66 R9.1 ; v1(38.23,277.26) 39.75,278.79 41.78,278.79 42.29,279.29 v1(42.29,280.31) ; v1(38.35,286.91) 38.99,287.55 R10.2 R3.1 ; v1(26.92,275.36) 29.66,278.09 v1(29.66,280.82)
$1N1964: length 19
  Bottom Layer w0.254: 62.64,289.64 R18.2 ; 62.64,289.64 64.9,287.39 64.9,278.5 U1#2.3 ; 62.64,289.64 62.64,289.93 62.09,290.48 58.3,290.48 57.95,290.13 R17.1
$1N1967: length 20.4
  Top Layer w0.254: v1(61.09,289.45) 61.85,290.21 64.77,290.21 65.57,289.41 v1(65.82,289.41)
  Bottom Layer w0.254: U1#2.1 59.05,278.5 59.05,285.64 58.67,286.02 58.67,289.87 58.93,290.12 60.42,290.12 R18.1 61.13,289.41 v1(61.09,289.45)
$1N1978: length 2.9
  Bottom Layer w0.254: 61.47,280.78 61.47,278.59 U1#2.2
$1N2081: length 13.7
  Top Layer w0.254: v1(81.41,285.01) 81.28,284.88 R3#3.1
  Bottom Layer w0.254: v1(81.41,285.01) 81.41,284.31 v1(85.19,280.53)
$1N2301: length 9.3
  Bottom Layer w0.254: R2#2.2 83.81,274.58 R23.2 83.31,271.55 81.81,270.04 R22#2.1 R2#2.4
$1N2309: length 9.2
  Bottom Layer w0.254: R2#2.3 86.23,274.47 R24.2 85.47,270.78 84.96,270.78 84.22,270.04 R23.1 83.81,266.99 R2#2.5
$1N2335: length 32.2
  Top Layer w0.254: 75.69,267.47 75.56,267.6 75.56,270.53 ; v1(81.28,280.82) 81.15,280.69 75.56,280.69 75.56,270.53 ; 75.56,270.53 v1(79.5,270.53)
  Bottom Layer w0.254: v1(79.5,270.53) 80.52,271.55 R22#2.2 R2#2.1 ; v1(81.28,280.82) 81.28,280.44 82.42,279.29 82.69,279.29 v1(83.92,280.53)
$1N2569: length 19
  Bottom Layer w0.254: U11.3 9.66,229.1 9.66,237.99 7.4,240.25 ; 7.4,240.25 7.4,240.53 6.85,241.08 3.06,241.08 2.72,240.73 R26.1 ; 7.4,240.25 7.4,240.01
$1N2572: length 20.4
  Top Layer w0.254: v1(10.59,240.01) 10.34,240.01 9.53,240.81 6.61,240.81 v1(5.85,240.05)
  Bottom Layer w0.254: U11.1 3.82,229.1 3.82,236.24 3.44,236.62 3.44,240.47 3.69,240.72 5.18,240.72 R27.1 5.89,240.01 v1(5.85,240.05)
$1N2583: length 2.9
  Bottom Layer w0.254: U5.3 6.23,229.19 U11.2
$1N2820: length 19
  Bottom Layer w0.254: 7.4,224.62 7.4,224.91 6.85,225.46 3.06,225.46 2.72,225.11 R30.1 ; 7.4,224.62 7.4,224.39 ; 7.4,224.62 9.66,222.37 9.66,213.48 U12.3
$1N2823: length 20.4
  Top Layer w0.254: v1(5.85,224.43) 6.61,225.19 9.53,225.19 10.34,224.39 v1(10.59,224.39)
  Bottom Layer w0.254: v1(5.85,224.43) 5.89,224.39 R31.1 5.18,225.1 3.69,225.1 3.44,224.85 3.44,221 3.82,220.62 3.82,213.48 U12.1
$1N2834: length 2.9
  Bottom Layer w0.254: U6.3 6.23,213.57 U12.2
$1N3003: length 9.3
  Bottom Layer w0.254: R22.4 18.29,219.62 18.82,219.62 20.32,221.13 R34.2 20.82,224.16 R22.2
$1N3011: length 9.2
  Bottom Layer w0.254: R22.3 23.24,224.05 R35.2 22.48,220.37 21.97,220.37 21.23,219.62 20.82,219.62 20.82,216.57 R22.5
$1N3184: length 9.3
  Bottom Layer w0.254: R21.4 R36.1 18.82,234.99 20.32,236.5 R37.2 20.82,239.53 R21.2
$1N3192: length 9.2
  Bottom Layer w0.254: R21.3 23.24,239.42 R38.2 22.48,235.73 21.97,235.73 21.23,234.99 R37.1 20.82,231.93 R21.5
$1N3292: length 53.4
  Top Layer w0.254: v1(24.89,220.24) 27.56,220.24 ; 27.56,220.24 41.24,220.24 v1(41.34,220.14) ; 27.56,220.24 27.56,236.11 v1(24.77,236.11)
  Bottom Layer w0.254: 23.37,234.72 23.37,234.86 R38.1 ; 23.37,234.72 R21.6 ; 23.37,234.72 v1(24.77,236.11) ; v1(41.34,220.14) 41.34,218.62 41.72,218.24 43.47,218.24 v1(44.83,219.6) ; v1(24.89,220.24) 24.89,218.08 R22.6 23.37,219.5 23.24,219.62
$1N3532: length 9.3
  Bottom Layer w0.254: 40.77,231.29 40.77,234.36 41.29,234.36 42.8,235.86 R41.2 43.3,238.9 RF.2
$1N3540: length 9.2
  Bottom Layer w0.254: 45.85,238.91 45.72,238.78 R42.2 44.96,235.1 44.45,235.1 43.71,234.36 43.3,234.36 43.3,231.3 RF.5
$1N3559: length 29.8
  Top Layer w0.254: 36.99,224.46 34.88,224.46 R1#3.1 ; 36.99,224.46 v1(40.83,224.46) ; 36.99,224.46 37.08,224.55 37.08,235.1 v1(39.37,235.1)
  Bottom Layer w0.254: 40.77,238.91 R40.2 40,235.1 v1(39.37,235.1) ; v1(40.83,224.46) 40.83,222.33 v1(43.56,219.6)
$1N4590: length 19
  Bottom Layer w0.254: 63.19,214.79 62.9,214.79 62.36,214.25 62.36,210.46 62.7,210.11 R44.1 ; 63.19,214.79 63.42,214.79 ; 63.19,214.79 65.44,217.05 74.33,217.05 U12#2.3
$1N4593: length 20.4
  Top Layer w0.254: v1(63.38,213.24) 62.62,214 62.62,216.93 63.42,217.73 v1(63.42,217.98)
  Bottom Layer w0.254: v1(63.38,213.24) 63.42,213.28 R45.1 62.71,212.58 62.71,211.08 62.97,210.83 66.81,210.83 67.19,211.21 74.33,211.21 U12#2.1
$1N4604: length 2.9
  Bottom Layer w0.254: U12#2.2 74.24,213.62 U8.3
$1N4614: length 19
  Bottom Layer w0.254: 80.67,214.85 80.38,214.85 79.84,214.3 79.84,210.51 80.18,210.17 R48.1 ; 80.67,214.85 R49.2 ; 80.67,214.85 82.93,217.11 91.81,217.11 U11#2.3
$1N4617: length 20.4
  Top Layer w0.254: v1(80.86,213.3) 80.1,214.06 80.1,216.98 80.9,217.78 v1(80.9,218.03)
  Bottom Layer w0.254: U11#2.1 91.81,211.27 84.67,211.27 84.29,210.88 80.45,210.88 80.19,211.14 80.19,212.63 R49.1 80.9,213.34 v1(80.86,213.3)
$1N4628: length 2.9
  Bottom Layer w0.254: U9.3 91.73,213.68 U11#2.2
$1N4635: length 9.3
  Bottom Layer w0.254: R1.2 81.87,228.02 R52.2 84.91,227.53 86.41,226.02 86.41,225.49 R1.4
$1N4643: length 9.2
  Bottom Layer w0.254: R1.3 81.99,230.45 R53.2 85.67,229.68 85.67,229.18 86.41,228.43 86.41,228.02 89.47,228.02 R1.5
$1N4651: length 9.3
  Bottom Layer w0.254: R2#3.4 R54.1 69.42,225.82 67.92,227.33 R55.2 64.88,227.82 R2#3.2
$1N4659: length 9.2
  Bottom Layer w0.254: R2#3.5 72.48,227.82 R55.1 69.42,228.23 68.68,228.98 68.68,229.48 R56.2 65,230.25 R2#3.3
$1N4698: length 9.3
  Bottom Layer w0.254: R3#2.4 R58.1 70.68,245.01 69.18,246.51 R59.2 66.14,247.01 R3#2.2
$1N4706: length 9.2
  Bottom Layer w0.254: R3#2.5 73.74,247.01 R59.1 70.68,247.42 69.94,248.16 69.94,248.67 R60.2 66.26,249.43 R3#2.3
$1N4742: length 68.2
  Top Layer w0.254: v1(85.82,232.09) 85.82,233.74 79.33,233.74 ; 79.33,233.74 79.33,239.5 ; 79.33,233.74 68.54,233.74 v1(68.54,231.71) ; 79.33,239.5 v1(79.33,244.58) ; 79.33,239.5 79.24,239.59 69.81,239.59 v1(69.81,243.02)
  Bottom Layer w0.254: v1(69.81,243.02) 69.81,243.84 R58.2 R3#2.1 ; v1(68.54,231.71) 71.15,231.71 R2#3.6 69.55,230.37 R56.1 ; v1(79.33,244.58) 81.46,244.58 v1(84.19,247.31) ; R1.6 86.54,230.57 86.41,230.45 86.41,231.5 v1(85.82,232.09)
$1N4816: length 13.4
  Top Layer w0.254: v1(83.64,245.09) 83.64,239.34 83.66,239.33 85.56,239.33 R0.1
  Bottom Layer w0.254: v1(84.19,248.58) 85.55,247.22 85.55,245.47 85.17,245.09 v1(83.64,245.09)
$1N5564: length 19
  Bottom Layer w0.254: R62.3 24.92,74.72 24.92,83.61 22.67,85.87 ; 22.67,85.87 R64.2 ; 22.67,85.87 22.67,86.15 22.12,86.7 18.33,86.7 17.98,86.35 R63.1
$1N5567: length 20.4
  Top Layer w0.254: v1(21.11,85.67) 21.88,86.43 24.8,86.43 25.6,85.63 v1(25.85,85.63)
  Bottom Layer w0.254: R62.1 19.08,74.72 19.08,81.86 18.7,82.24 18.7,86.09 18.96,86.34 20.45,86.34 R64.1 21.16,85.63 v1(21.11,85.67)
$1N5578: length 2.9
  Bottom Layer w0.254: R62.2 21.5,74.81 U11#3.3
$1N5588: length 19
  Bottom Layer w0.254: R67.1 18.65,50.45 19,50.8 22.79,50.8 23.33,50.26 23.33,49.97 ; R66.3 25.59,38.83 25.59,47.71 23.33,49.97 ; 23.33,49.97 R68.2
$1N5591: length 20.4
  Top Layer w0.254: v1(21.78,49.78) 22.54,50.54 25.46,50.54 26.27,49.73 v1(26.52,49.73)
  Bottom Layer w0.254: R66.1 19.75,38.83 19.75,45.97 19.37,46.35 19.37,50.19 19.62,50.44 21.12,50.44 21.83,49.73 21.82,49.73 v1(21.78,49.78)
$1N5602: length 2.9
  Bottom Layer w0.254: U12#3.3 22.16,38.91 R66.2
$1N5609: length 9.3
  Bottom Layer w0.254: SW13.4 R70.1 56.7,62.06 58.2,63.56 58.7,63.56 58.7,66.6 SW13.2
$1N5617: length 9.2
  Bottom Layer w0.254: SW13.3 61.12,66.48 61.12,63.56 60.36,62.8 59.85,62.8 59.11,62.06 R71.1 58.7,59 SW13.5
$1N5625: length 9.3
  Bottom Layer w0.254: SW14.4 R73.1 59.38,99.1 60.89,100.6 R74.2 61.38,103.64 SW14.2
$1N5633: length 9.2
  Bottom Layer w0.254: SW14.5 61.38,96.04 R74.1 61.8,99.1 62.54,99.84 63.05,99.84 R75.2 63.81,103.52 SW14.3
$1N5932: length 9.3
  Bottom Layer w0.254: SW15.4 98.1,98.46 98.63,98.46 100.13,99.97 R77.2 100.63,103 SW15.2
$1N5940: length 9.2
  Bottom Layer w0.254: SW15.5 100.63,95.41 100.63,98.46 101.04,98.46 101.78,99.21 102.29,99.21 R78.2 103.05,102.89 SW15.3
$1N5959: length 11.9
  Bottom Layer w0.254: v1(86.42,73.71) 86.42,72.19 86.8,71.8 88.55,71.8 v1(89.92,73.17) ; R76.2 SW15.1 ; R75.1 63.94,98.97 SW14.6
$1N6163: length 9.3
  Bottom Layer w0.254: SW16.4 R79.1 100.89,57.36 102.4,58.86 R80.2 102.89,61.9 SW16.2
$1N6171: length 9.2
  Bottom Layer w0.254: SW16.5 102.89,54.3 R80.1 103.31,57.36 104.05,58.1 104.55,58.1 R81.2 105.32,61.78 SW16.3
$1N6191: length 12.2
  Bottom Layer w0.254: R79.2 SW16.1 ; R72.1 61.25,61.93 SW13.6 ; v1(85.92,78.03) 85.92,75.9 v1(88.65,73.17)
$1N6501: length 19
  Bottom Layer w0.254: 27.03,-7.66 29.29,-9.92 29.29,-18.81 R83.3 ; 27.03,-7.66 R85.2 ; 27.03,-7.66 27.03,-7.38 26.49,-6.83 22.7,-6.83 22.35,-7.18 R84.1
$1N6504: length 20.4
  Top Layer w0.254: v1(25.48,-7.86) 26.24,-7.1 29.16,-7.1 29.97,-7.9 v1(30.22,-7.9)
  Bottom Layer w0.254: v1(25.48,-7.86) 25.52,-7.9 R85.1 24.81,-7.19 23.32,-7.19 23.07,-7.44 23.07,-11.29 23.45,-11.67 23.45,-18.81 R83.1
$1N6515: length 2.9
  Bottom Layer w0.254: U14.3 25.86,-18.72 R83.2
$1N6753: length 19
  Bottom Layer w0.254: R88.1 21.03,24.11 21.37,24.46 25.17,24.46 25.71,23.91 25.71,23.63 ; R87.3 27.97,12.48 27.97,21.37 25.71,23.63 ; 25.71,23.63 R89.2
$1N6756: length 20.4
  Top Layer w0.254: v1(28.9,23.39) 28.65,23.39 27.84,24.19 24.92,24.19 v1(24.16,23.43)
  Bottom Layer w0.254: v1(24.16,23.43) 24.2,23.39 R89.1 23.49,24.1 22,24.1 21.75,23.85 21.75,20 22.13,19.62 22.13,12.48 R87.1
$1N6767: length 2.9
  Bottom Layer w0.254: R87.2 24.54,12.57 U15.3
$1N7112: length 9.3
  Bottom Layer w0.254: SW17.4 R91.1 86.92,17.44 88.43,18.95 R92.2 88.92,21.98 SW17.2
$1N7120: length 9.2
  Bottom Layer w0.254: SW17.5 88.92,14.38 R92.1 89.33,17.44 90.08,18.18 90.58,18.18 R93.2 91.35,21.86 SW17.3
$1N7297: length 9.3
  Bottom Layer w0.254: SW18.4 R94.1 82.88,-3.37 84.38,-1.86 R95.2 84.88,1.17 SW18.2
$1N7305: length 9.2
  Bottom Layer w0.254: SW18.5 84.88,-6.42 R95.1 85.29,-3.37 86.03,-2.62 86.54,-2.62 R96.2 87.3,1.06 SW18.3
$1N7478: length 9.3
  Bottom Layer w0.254: SW19.2 87.92,-18.13 R98.2 87.43,-21.16 85.92,-22.67 R97.1 SW19.4
$1N7486: length 9.2
  Bottom Layer w0.254: SW19.3 90.35,-18.25 R99.2 89.58,-21.93 89.08,-21.93 88.34,-22.67 R98.1 87.92,-25.73 SW19.5
$1N7519: length 12.1
  Bottom Layer w0.254: v1(86.3,45.01) 86.3,42.88 v1(89.03,40.15) ; R91.2 SW17.1 ; R94.2 SW18.1
$1N7528: length 19.8
  Bottom Layer w0.254: v1(87.76,40.15) 87.44,40.46 87.44,41.23 87.09,41.58 86.04,41.58 86.04,38.91 86.8,38.15 90.87,38.15 v1(95.19,42.47) ; R93.1 91.47,17.31 SW17.6
$1N7610: length 12.2
  Bottom Layer w0.254: SW18.6 87.43,-3.49 R96.1 ; v1(87.81,-41.45) 85.08,-38.72 v1(85.08,-36.59) ; R99.1 90.48,-22.8 SW19.6
$1N7723: length 19.7
  Bottom Layer w0.254: R97.2 SW19.1 ; v1(93.97,-39.13) 89.65,-43.45 85.59,-43.45 84.83,-42.69 84.83,-40.02 85.88,-40.02 86.23,-40.37 86.23,-41.14 v1(86.54,-41.45)
$1N7950: length 9.3
  Bottom Layer w0.254: SW20.2 130.65,11.17 R103.2 130.16,8.14 128.65,6.63 R102.1 SW20.4
$1N7958: length 9.2
  Bottom Layer w0.254: SW20.3 133.08,11.06 R104.2 132.31,7.37 131.81,7.37 131.06,6.63 R103.1 130.65,3.58 SW20.5
$1N8133: length 9.3
  Bottom Layer w0.254: SW21.2 120.26,-37.43 R106.2 119.76,-40.46 118.26,-41.97 R105.1 SW21.4
$1N8141: length 9.2
  Bottom Layer w0.254: SW21.5 120.26,-45.02 R106.1 120.67,-41.97 121.41,-41.22 121.92,-41.22 R107.2 122.68,-37.54 122.81,-37.41
$1N8558: length 8.8
  Bottom Layer w0.254: v1(131.34,-10.91) 129.98,-12.27 128.23,-12.27 127.85,-11.89 v1(127.85,-10.37) ; R105.2 SW21.1
$1N8570: length 9
  Bottom Layer w0.254: v1(130.07,-10.91) 127.34,-8.18 v1(127.34,-6.05) ; R102.2 SW20.1
$1N8808: length 19
  Bottom Layer w0.254: 163.41,61.52 R110.2 ; 163.41,61.52 163.41,61.81 162.86,62.35 159.07,62.35 158.72,62 R109.1 ; 163.41,61.52 165.66,59.26 165.66,50.38 R108.3
$1N8811: length 20.4
  Top Layer w0.254: v1(161.85,61.33) 162.62,62.09 165.54,62.09 166.34,61.28 v1(166.59,61.28)
  Bottom Layer w0.254: v1(161.85,61.33) 161.9,61.28 R110.1 161.19,62 159.69,62 159.44,61.74 159.44,57.9 159.82,57.52 159.82,50.38 R108.1
$1N8822: length 2.9
  Bottom Layer w0.254: R108.2 162.24,50.46 U19.3
$1N9066: length 9.3
  Bottom Layer w0.254: SW22.4 R112.1 175.06,77.68 176.57,79.18 R113.2 177.06,82.22 SW22.2
$1N9074: length 9.2
  Bottom Layer w0.254: SW22.5 177.06,74.62 R113.1 177.47,77.68 178.22,78.42 178.72,78.42 R114.2 179.49,82.1 SW22.3
$1N9426: length 9.1
  Bottom Layer w0.254: R114.1 179.61,77.55 SW22.6 ; v1(213.17,51.1) 213.17,48.97 v1(215.9,46.24)
$1N10669: length 19
  Bottom Layer w0.254: 266.15,54.66 266.15,54.95 265.6,55.49 261.81,55.49 261.47,55.15 261.47,54.43 ; 266.15,54.66 268.41,52.4 268.41,43.52 R116.3 ; 266.15,54.66 R118.2
$1N10672: length 20.4
  Top Layer w0.254: v1(269.33,54.43) 269.08,54.43 268.28,55.23 265.36,55.23 v1(264.6,54.47)
  Bottom Layer w0.254: v1(264.6,54.47) 264.64,54.43 R118.1 263.93,55.14 262.44,55.14 262.18,54.88 262.18,51.04 262.56,50.66 262.56,43.52 R116.1
$1N10683: length 2.9
  Bottom Layer w0.254: R116.2 264.98,43.6 U21.3
$1N10903: length 9.3
  Bottom Layer w0.254: SW25.2 312.03,96.78 R121.2 311.53,93.75 310.03,92.24 R120.1 309.5,89.17
$1N10911: length 9.2
  Bottom Layer w0.254: SW25.5 312.03,89.19 R121.1 312.44,92.24 313.18,92.98 313.69,92.98 R122.2 314.45,96.67 SW25.3
$1N11228: length 9
  Bottom Layer w0.254: v1(295.21,45.26) 295.21,43.13 v1(297.94,40.4) ; R120.2 309.5,96.79

## Text on the board
Top Silkscreen Layer: 单个1K | 电阻有效 | 电阻无效 | 开 | 同相加法器 | A= | A= - | 反相比例器 | out1 | out3 | Vo | 同相比例器 | 反相加法器 | out2 | out4 | R2 | R1 | + | -
